# Altium schematic sheet sensor.SchDoc
size A
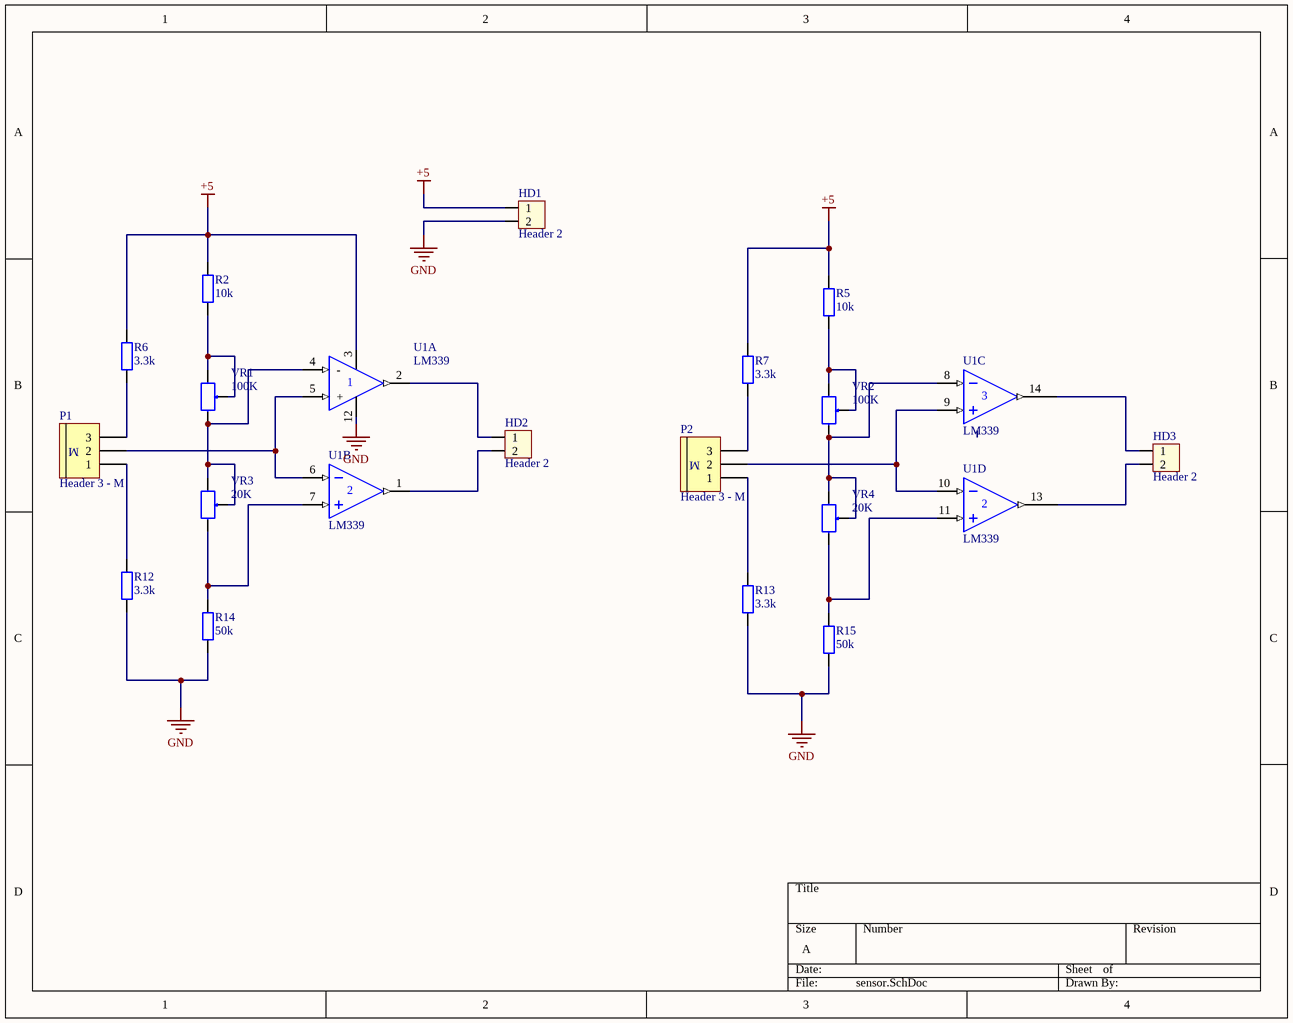
[diagram p0: sensor.SchDoc]

## Parts
HD1  Header 2  [HED2]
HD2  Header 2  [HED2]
HD3  Header 2  [HED2]
P1  Header 3 - M  [Medium - Header 3]
P2  Header 3 - M  [Medium - Header 3]
R2  10k  [R1/4W]
R5  10k  [R1/4W]
R6  3.3k  [R1/4W]
R7  3.3k  [R1/4W]
R12  3.3k  [R1/4W]
R13  3.3k  [R1/4W]
R14  50k  [R1/4W]
R15  50k  [R1/4W]
U1  LM339  [DIP14]  (parts A,B,C,D of 4)
VR1  100K  [VR]
VR2  100K  [VR]
VR3  20K  [VR]
VR4  20K  [VR]

## Nets
+5: HD1.1 R2.2 R5.2 R6.2 R7.2 U1.3(VCC)
GND: HD1.2 R12.1 R13.1 R14.1 R15.1 U1.12(GND)
NetHD2_1: HD2.1 U1.2(OUT)
NetHD2_2: HD2.2 U1.1(OUT)
NetHD3_1: HD3.1 U1.14
NetHD3_2: HD3.2 U1.13
NetP1_1: P1.1 R12.2
NetP1_2: P1.2 U1.5(+) U1.6(IN-)
NetP1_3: P1.3 R6.1
NetP2_1: P2.1 R13.2
NetP2_2: P2.2 U1.9(IN-) U1.10(IN-)
NetP2_3: P2.3 R7.1
NetR2_1: R2.1 VR1.1 VR1.2
NetR5_1: R5.1 VR2.1 VR2.2
NetR14_2: R14.2 U1.7(IN+) VR3.3
NetR15_2: R15.2 U1.11(IN+) VR4.3
NetU1_4: U1.4(-) VR1.3 VR3.1 VR3.2
NetU1_8: U1.8(OUT) VR2.3 VR4.1 VR4.2

## Notes on the sheet
- (in symbol Header 3 - M) M

## Library data of the parts
HD1-HD3 = Hed2: Header 2 (Green); Value: Header 2
P1 P2 = Header 3 - M: Header, 3-Pin, Medium; LatestRevisionDate: 17-Jul-2002; LatestRevisionNote: Re-released for DXP Platform.; Publisher: Altium Limited
R2 R5-R7 R12-R15 = R1/4W: Resistor 1/4W; Value: R1/4W - 1K
U1 = LM339: Low Power Low Offset Voltage Quad Comparators
VR1-VR4 = VR: Var Resistor; Value: VR 10K